# EAGLE schematic thor2 (EAGLE 9.6.2)
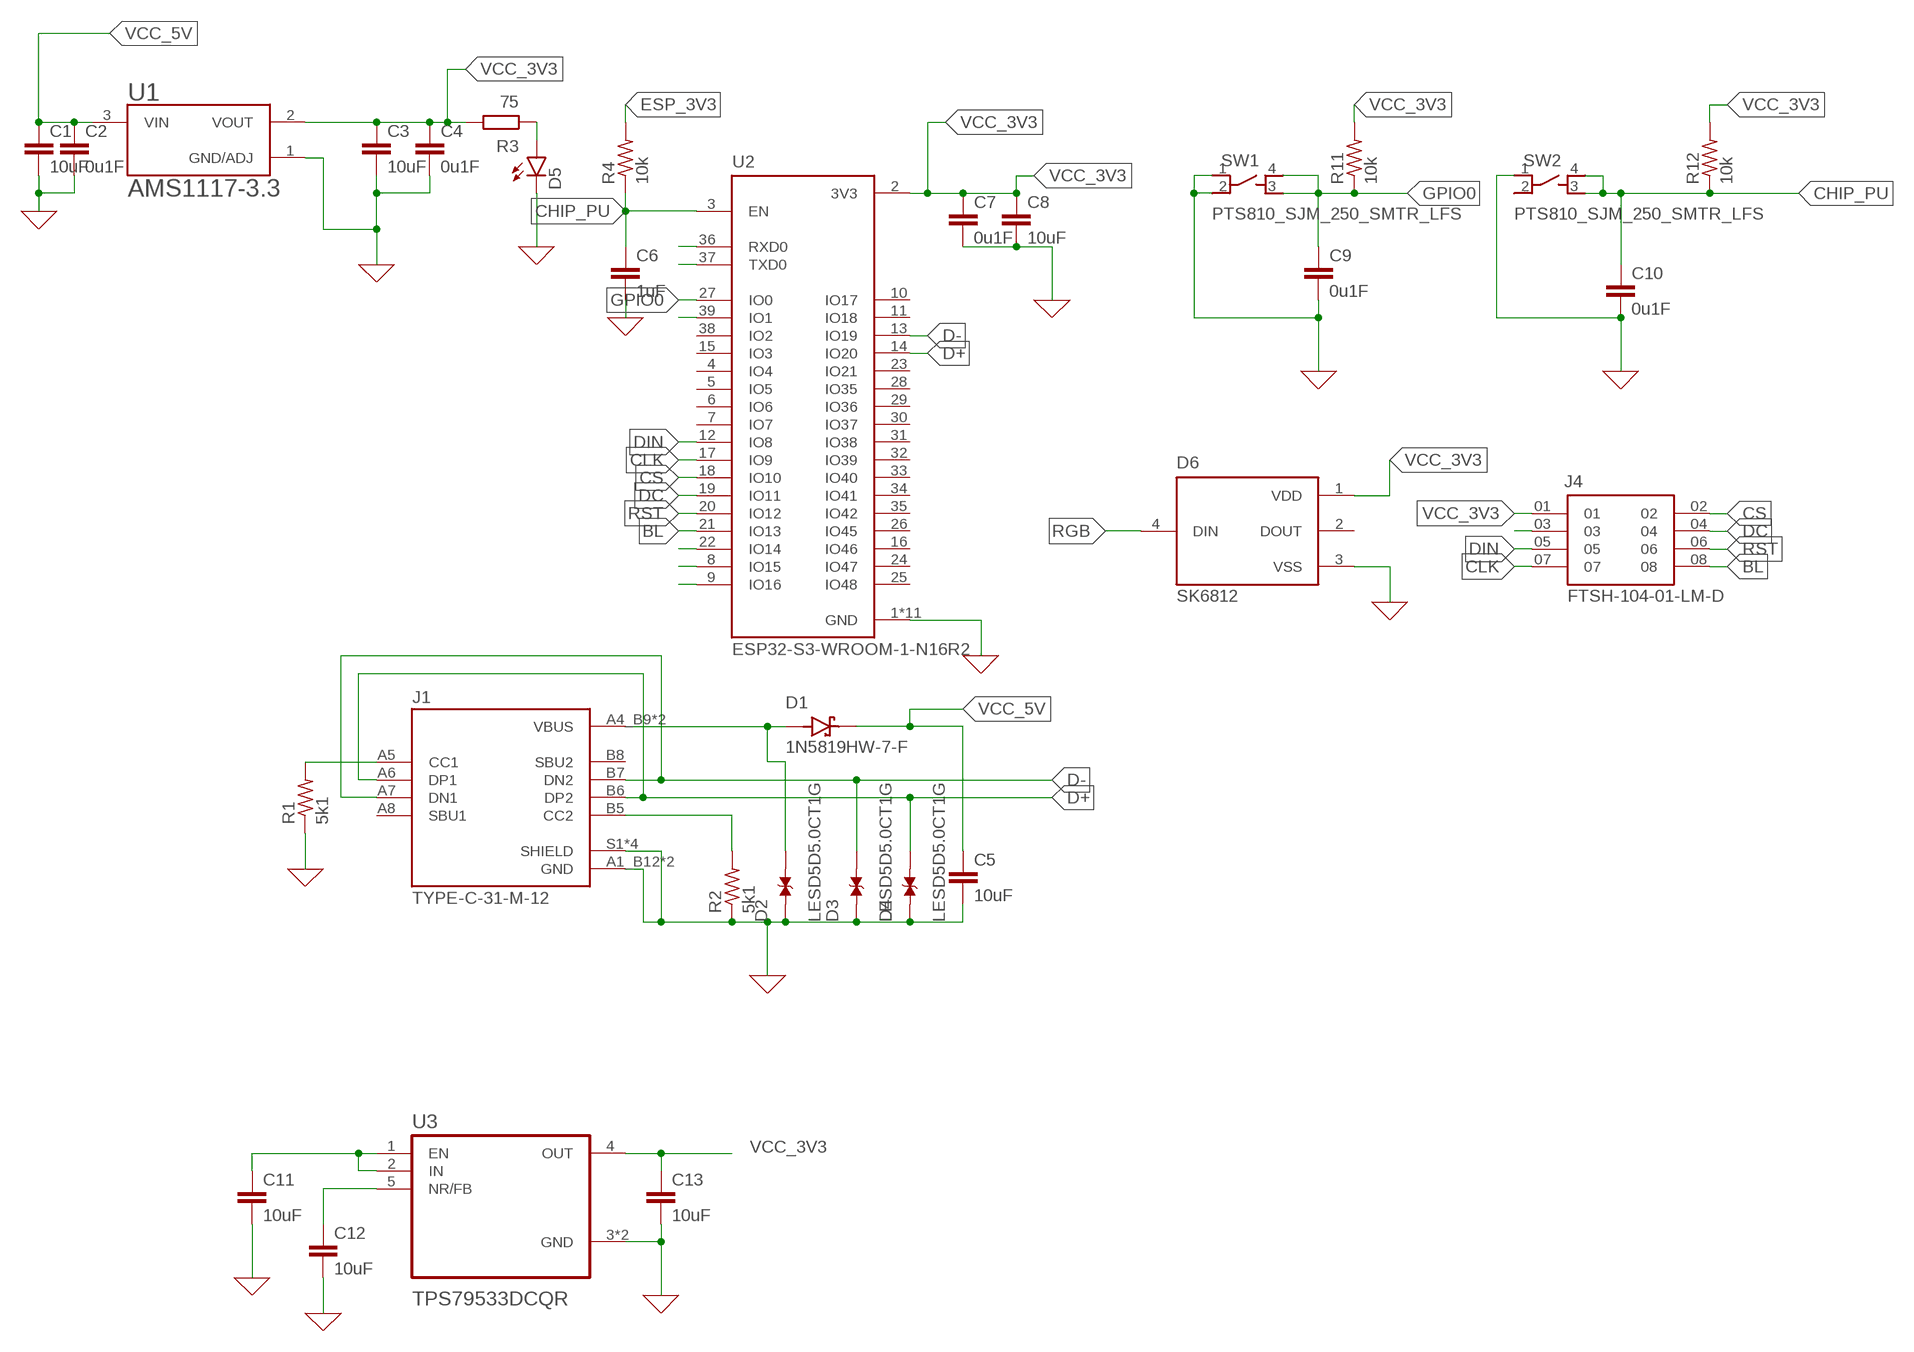
[diagram p0: schematic, sheet 1]

## Parts
C1  10uF  C2,5-3  [C2.5-3]
C2  0u1F  C2,5-3  [C2.5-3]
C3  10uF  C2,5-3  [C2.5-3]
C4  0u1F  C2,5-3  [C2.5-3]
C5  10uF  C2,5-3  [C2.5-3]
C6  1uF  C2,5-3  [C2.5-3]
C7  0u1F  C2,5-3  [C2.5-3]
C8  10uF  C2,5-3  [C2.5-3]
C9  0u1F  C2,5-3  [C2.5-3]
C10  0u1F  C2,5-3  [C2.5-3]
C11  10uF  C2,5-3  [C2.5-3]
C12  10uF  C2,5-3  [C2.5-3]
C13  10uF  C2,5-3  [C2.5-3]
D1  1N5819HW-7-F  [SOD3715X145N]
D2  LESD5D5.0CT1G  [TVS_LESD5D5.0CT1G]
D3  LESD5D5.0CT1G  [TVS_LESD5D5.0CT1G]
D4  LESD5D5.0CT1G  [TVS_LESD5D5.0CT1G]
D5  LED  [SMARTLED-TTW]
D6  SK6812  [LED_SK6812]
J1  TYPE-C-31-M-12  [HRO_TYPE-C-31-M-12]
J4  FTSH-104-01-LM-D  [SAMTEC_FTSH-104-01-LM-D]
R1  5k1  R-US_R1206  [R1206]
R2  5k1  R-US_R1206  [R1206]
R3  75  R  (no package)
R4  10k  R-US_R1206  [R1206]
R11  10k  R-US_R1206  [R1206]
R12  10k  R-US_R1206  [R1206]
SW1  PTS810_SJM_250_SMTR_LFS  [SW_PTS810_SJM_250_SMTR_LFS]
SW2  PTS810_SJM_250_SMTR_LFS  [SW_PTS810_SJM_250_SMTR_LFS]
U1  AMS1117-3.3  [SOT229P700X180-4N]
U2  ESP32-S3-WROOM-1-N16R2  [XCVR_ESP32-S3-WROOM-1-N16R2]
U3  TPS79533DCQR  [SOT127P706X180-6N]

## Nets
0: C1.2 C2.2 C3.2 C4.2 C5.2 C6.2 C7.2 C8.2 C9.2 C10.2 C11.2 C12.2 C13.2 D2.1 D3.1 D4.1 D5.C@1(C) D6.3(VSS) J1.A1_B12(GND) J1.B1_A12(GND) J1.S1(SHIELD) J1.S2(SHIELD) J1.S3(SHIELD) J1.S4(SHIELD) R1.1 R2.1 SW1.1 SW1.2 SW2.1 U1.1(GND/ADJ) U2.1(GND) U2.40(GND) U2.41_1(GND) U2.41_2(GND) U2.41_3(GND) U2.41_4(GND) U2.41_5(GND) U2.41_6(GND) U2.41_7(GND) U2.41_8(GND) U2.41_9(GND) U3.3(GND) U3.6(GND) ; supply symbol labelled GND
BL: J4.08 U2.21(IO13)
CHIP_PU: C6.1 C10.1 R4.1 R12.1 SW2.3 SW2.4 U2.3(EN)
CLK: J4.07 U2.17(IO9)
CS: J4.02 U2.18(IO10)
D+: D4.2 J1.A6(DP1) J1.B6(DP2) U2.14(IO20)
D-: D3.2 J1.A7(DN1) J1.B7(DN2) U2.13(IO19)
DC: J4.04 U2.19(IO11)
DIN: J4.05 U2.12(IO8)
ESP_3V3: R4.2
GPIO0: C9.1 R11.1 SW1.3 SW1.4 U2.27(IO0)
N$1: C11.1 U3.1(EN) U3.2(IN)
N$2: U2.36(RXD0)
N$3: U2.37(TXD0)
N$4: J1.A5(CC1) R1.2
N$5: U2.39(IO1)
N$6: J1.B5(CC2) R2.2
N$7: D1.A D2.2 J1.A4_B9(VBUS) J1.B4_A9(VBUS)
N$8: D5.A@1(A) R3.1
N$9: U2.22(IO14)
N$10: U2.8(IO15)
N$11: U2.9(IO16)
N$13: J4.03
N$14: C12.1 U3.5(NR/FB)
RGB: D6.4(DIN)
RST: J4.06 U2.20(IO12)
VCC_3V3: C3.1 C4.1 C7.1 C8.1 C13.1 D6.1(VDD) J4.01 R3.2 R11.2 R12.2 U1.2(VOUT) U2.2(3V3) U3.4(OUT)
VCC_5V: C1.1 C2.1 C5.1 D1.C(K) U1.3(VIN)
Unconnected: D6.2(DOUT) J1.A8(SBU1) J1.B8(SBU2) SW2.2 U2.4(IO4) U2.5(IO5) U2.6(IO6) U2.7(IO7) U2.10(IO17) U2.11(IO18) U2.15(IO3) U2.16(IO46) U2.23(IO21) U2.24(IO47) U2.25(IO48) U2.26(IO45) U2.28(IO35) U2.29(IO36) U2.30(IO37) U2.31(IO38) U2.32(IO39) U2.33(IO40) U2.34(IO41) U2.35(IO42) U2.38(IO2)

## Library data of the parts
C1-C13 = capacitor-wima:C: CAPACITOR naming: grid - package width
D1 = 1N5819HW-7-F:1N5819HW-7-F: 1N5819HW Series 40 V 1 A Surface Mount Schottky Barrier Rectifier - SOD-123 Check availability <https://pricing.snapeda.com/parts/1N5819HW-7-F/Multicomp/view-part?ref=eda>; AVAILABILITY: In Stock; CHECK_PRICES: https://www.snapeda.com/parts/1N5819HW-7-F/Multicomp/view-part/?ref=eda; DESCRIPTION: Diode Schottky 40V 1A Surface Mount SOD-123; MF: Multicomp; MP: 1N5819HW-7-F; PACKAGE: SOD-123 Multicomp; PRICE: None; SNAPEDA_LINK: https://www.snapeda.com/parts/1N5819HW-7-F/Multicomp/view-part/?ref=snap
D2-D4 = LESD5D5.0CT1G:LESD5D5.0CT1G: Check availability <https://pricing.snapeda.com/parts/LESD5D5.0CT1G/Leshan%20Radio%20Co./view-part?ref=eda>; AVAILABILITY: In Stock; CHECK_PRICES: https://www.snapeda.com/parts/LESD5D5.0CT1G/Leshan+Radio+Co./view-part/?ref=eda; DESCRIPTION: Transient Voltage Suppressors for ESD Protection; MF: Leshan Radio Co.; MP: LESD5D5.0CT1G; PACKAGE: None; PRICE: None; SNAPEDA_LINK: https://www.snapeda.com/parts/LESD5D5.0CT1G/Leshan+Radio+Co./view-part/?ref=snap
D5 = led:LED: LED OSRAM: - CHIPLED LG R971, LG N971, LY N971, LG Q971, LY Q971, LO R971, LY R971 LH N974, LH R974 LS Q976, LO Q976, LY Q976 LO Q996 - Hyper CHIPLED LW Q18S LB Q993, LB Q99A, LB R99A - SideLED LS A670, LO A670, LY A670, LG A670, LP A670 LB A673, LV A673, LT A673, LW A673 LH A674 LY A675 LS A676, LA A676, LO A676, LY A676, LW A676 LS A679, LY A679, LG A679 - Hyper Micro SIDELED® LS Y876, LA Y876, LO Y876, LY Y876 LT Y87S - SmartLED LW L88C, LW L88S LB L89C, LB L89S, LG L890 LS L89K, LO L89K, LY L89K LS L896, LA L896, LO L896, LY L896 - TOPLED LS T670, LO T670, LY T670, LG T670, LP T670 LSG T670, LSP T670, LSY T670, LOP T670, LYG T670 LG T671, LOG T671, LSG T671 LB T673, LV T673, LT T673, LW T673 LH T674 LS T676, LA T676, LO T676, LY T676, LB T676, LH T676, LSB T676, LW T676 LB T67C, LV T67C, LT T67C, LS T67K, LO T67K, LY T67K, LW E67C LS E67B, LA E67B, LO E67B, LY E67B, LB E67C, LV E67C, LT E67C LW T67C LS T679, LY T679, LG T679 LS T770, LO T770, LY T770, LG T770, LP T770 LB T773, LV T773, LT T773, LW T773 LH T774 LS E675, LA E675, LY E675, LS T675 LS T776, LA T776, LO T776, LY T776, LB T776 LHGB T686 LT T68C, LB T68C - Hyper Mini TOPLED® LB M676 - Mini TOPLED Santana® LG M470 LS M47K, LO M47K, LY M47K Source: http://www.osram.convergy.de LUXEON: - LUMILED® LXK2-PW12-R00, LXK2-PW12-S00, LXK2-PW14-U00, LXK2-PW14-V00 LXK2-PM12-R00, LXK2-PM12-S00, LXK2-PM14-U00 LXK2-PE12-Q00, LXK2-PE12-R00, LXK2-PE12-S00, LXK2-PE14-T00, LXK2-PE14-U00 LXK2-PB12-K00, LXK2-PB12-L00, LXK2-PB12-M00, LXK2-PB14-N00, LXK2-PB14-P00, LXK2-PB14-Q00 LXK2-PR12-L00, LXK2-PR12-M00, LXK2-PR14-Q00, LXK2-PR14-R00 LXK2-PD12-Q00, LXK2-PD12-R00, LXK2-PD12-S00 LXK2-PH12-R00, LXK2-PH12-S00 LXK2-PL12-P00, LXK2-PL12-Q00, LXK2-PL12-R00 Source: www.luxeon.com KINGBRIGHT: KA-3528ASYC Source: www.kingbright.com
D6 = SK6812:SK6812: SMD 5050 Full color RGB LED data transmission frequency up to 800Kbps, with 30 fps refresh rate, 5.00x5.00 mm Check availability <https://pricing.snapeda.com/parts/SK6812/Opsco/view-part?ref=eda>; AVAILABILITY: Not in stock; CHECK_PRICES: https://www.snapeda.com/parts/SK6812/Opsco/view-part/?ref=eda; DESCRIPTION: 5.5x5.0x1.6mm Top SMD Type 0.2Watt Power targeted light source Intelligent control LED; MF: Opsco; MP: SK6812; PACKAGE: None; PRICE: None; SNAPEDA_LINK: https://www.snapeda.com/parts/SK6812/Opsco/view-part/?ref=snap
J1 = TYPE-C-31-M-12:TYPE-C-31-M-12: Check availability <https://pricing.snapeda.com/parts/TYPE-C-31-M-12/HRO%20Electronics%20Co.%2C%20Ltd./view-part?ref=eda>; AVAILABILITY: Not in stock; CHECK_PRICES: https://www.snapeda.com/parts/TYPE-C-31-M-12/HRO+Electronics+Co.%252C+Ltd./view-part/?ref=eda; DESCRIPTION: USB Connectors 24 Receptacle 1 8.94*7.3mm RoHS; MF: HRO Electronics Co., Ltd.; MP: TYPE-C-31-M-12; PACKAGE: Package; PRICE: None; SNAPEDA_LINK: https://www.snapeda.com/parts/TYPE-C-31-M-12/HRO+Electronics+Co.%252C+Ltd./view-part/?ref=snap
J4 = FTSH-104-01-LM-D:FTSH-104-01-LM-D: Check availability <https://pricing.snapeda.com/parts/FTSH-104-01-LM-D/Samtec/view-part?ref=eda>; AVAILABILITY: In Stock; CHECK_PRICES: https://www.snapeda.com/parts/FTSH-104-01-LM-D/Samtec/view-part/?ref=eda; DESCRIPTION: Connector Header Surface Mount 8 position 0.050 (1.27mm); MF: Samtec; MP: FTSH-104-01-LM-D; PACKAGE: None; PRICE: None; SNAPEDA_LINK: https://www.snapeda.com/parts/FTSH-104-01-LM-D/Samtec/view-part/?ref=snap
R1 R2 R4 R11 R12 = rcl:R-US_: RESISTOR, American symbol; SPICEPREFIX: R
R3 = ngspice-simulation:R: RESISTOR
SW1 SW2 = PTS810_SJM_250_SMTR_LFS:PTS810_SJM_250_SMTR_LFS: Switch Tactile Spst-No 0.05a 16v Check availability <https://pricing.snapeda.com/parts/PTS810%20SJM%20250%20SMTR%20LFS/C%26K/view-part?ref=eda>; AVAILABILITY: In Stock; CHECK_PRICES: https://www.snapeda.com/parts/PTS810%20SJM%20250%20SMTR%20LFS/C%2526K/view-part/?ref=eda; DESCRIPTION: Tactile Switch SPST-NO Top Actuated Surface Mount; MF: C&K; MP: PTS810 SJM 250 SMTR LFS; PACKAGE: None; PRICE: None; SNAPEDA_LINK: https://www.snapeda.com/parts/PTS810%20SJM%20250%20SMTR%20LFS/C%2526K/view-part/?ref=snap
U1 = AMS1117-3.3:AMS1117-3.3: Check availability <https://pricing.snapeda.com/parts/AMS1117-3.3/Advanced%20Monolithic%20Systems/view-part?ref=eda>; AVAILABILITY: Not in stock; CHECK_PRICES: https://www.snapeda.com/parts/AMS1117-3.3/Advanced+Monolithic+Systems/view-part/?ref=eda; DESCRIPTION: Sot223/Pkg 1-Amp 3.3-Volt Low Drop Out Voltage Regulatator; MF: Advanced Monolithic Systems; MP: AMS1117-3.3; PACKAGE: SOT-223 Seeed Technology; PRICE: None; SNAPEDA_LINK: https://www.snapeda.com/parts/AMS1117-3.3/Advanced+Monolithic+Systems/view-part/?ref=snap
U2 = ESP32-S3-WROOM-1-N16R2:ESP32-S3-WROOM-1-N16R2: Check availability <https://pricing.snapeda.com/parts/ESP32-S3-WROOM-1-N16R2/Espressif%20Systems/view-part?ref=eda>; AVAILABILITY: In Stock; CHECK_PRICES: https://www.snapeda.com/parts/ESP32-S3-WROOM-1-N16R2/Espressif+Systems/view-part/?ref=eda; DESCRIPTION: Bluetooth, WiFi 802.11b/g/n, Bluetooth v5.0 Transceiver Module 2.4GHz PCB Trace Surface Mount; MF: Espressif Systems; MP: ESP32-S3-WROOM-1-N16R2; PACKAGE: NON STANDARD Espressif Systems; PRICE: None; PURCHASE-URL: https://www.snapeda.com/api/url_track_click_mouser/?unipart_id=11099128&manufacturer=Espressif Systems&part_name=ESP32-S3-WROOM-1-N16R2&search_term=None; SNAPEDA_LINK: https://www.snapeda.com/parts/ESP32-S3-WROOM-1-N16R2/Espressif+Systems/view-part/?ref=snap
U3 = TPS79533DCQR:TPS79533DCQR: Check availability <https://pricing.snapeda.com/parts/TPS79533DCQR/Texas%20Instruments/view-part?ref=eda>; AVAILABILITY: In Stock; CHECK_PRICES: https://www.snapeda.com/parts/TPS79533DCQR/Texas+Instruments/view-part/?ref=eda; DESCRIPTION: 500-mA, low-dropout voltage regulator with enable; MF: Texas Instruments; MP: TPS79533DCQR; PACKAGE: SOT-223-6 Texas Instruments; PRICE: None; PURCHASE-URL: https://www.snapeda.com/api/url_track_click_mouser/?unipart_id=229826&manufacturer=Texas Instruments&part_name=TPS79533DCQR&search_term=tps79533; SNAPEDA_LINK: https://www.snapeda.com/parts/TPS79533DCQR/Texas+Instruments/view-part/?ref=snap